# EAGLE design sdramps (EAGLE 5.11)
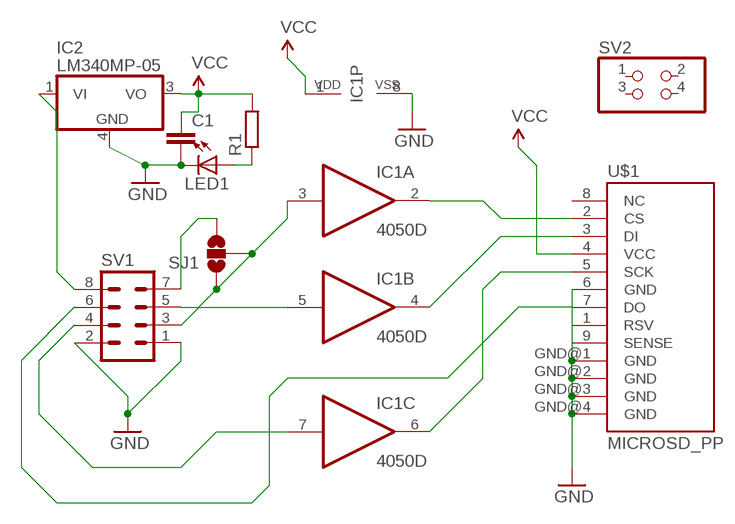
[diagram p0: schematic, sheet 1]

## Parts
C1  C-EUC1206K  [C1206K]
IC1  4050D  [SO16]
IC2  LM340MP-05  [SOT223]
LED1  LED1206  [LED-1206]
R1  R-EU_R1206W  [R1206W]
SJ1  SOLDERJUMPER_2WAYT  [SJ_2]
SV1  MA04-2  [MA04-2]
SV2  PINHD-2X2  [2X02]
U$1  MICROSD_PP  [MICROSD_PP]

## Nets
GND: C1.2 IC1.8(P:VSS) IC2.4(GND) LED1.C SV1.1 SV1.2 U$1.6(GND) U$1.GND@1(GND) U$1.GND@2(GND) U$1.GND@3(GND) U$1.GND@4(GND)
N$1: IC1.2(A:O) U$1.2(CS)
N$2: IC1.4(B:O) U$1.3(DI)
N$3: IC1.6(C:O) U$1.5(SCK)
N$4: SV1.6 U$1.7(DO)
N$5: SJ1.3 SV1.7
N$6: IC1.3(A:I) SJ1.1 SJ1.2 SV1.3
N$8: IC1.7(C:I) SV1.4
N$9: IC1.5(B:I) SV1.5
N$10: IC2.1(VI) SV1.8
N$11: LED1.A R1.1
VCC: C1.1 IC1.1(P:VDD) IC2.3(VO) R1.2 U$1.4(VCC)
Unconnected: IC1.9(D:I) IC1.10(D:O) IC1.11(E:I) IC1.12(E:O) IC1.14(F:I) IC1.15(F:O) SV2.1 SV2.2 SV2.3 SV2.4 U$1.1(RSV) U$1.8(NC) U$1.9(SENSE)

## Library data of the parts
C1 = rcl:C-EU: CAPACITOR, European symbol
IC1 = 40xx:4050: Hex non-inverting BUFFER
IC2 = linear:LM340?-*: Positive VOLTAGE REGULATOR Source: http://cache.national.com/ds/LM/LM340.pdf
LED1 = SparkFun:LED: LEDs Standard schematic elements and footprints for 5mm, 3mm, 1206, and 0603 sized LEDs. 5mm - Spark Fun Electronics SKU : COM-00529 (and others)
R1 = rcl:R-EU_: RESISTOR, European symbol
SJ1 = SparkFun:SOLDERJUMPER_2WAY: Solder Jumper 2 way solder jumper
SV1 = con-lstb:MA04-2: PIN HEADER; OC_FARNELL: unknown; OC_NEWARK: unknown
SV2 = pinhead:PINHD-2X2: PIN HEADER
U$1 = DE1594:MICROSD_PP

## Board
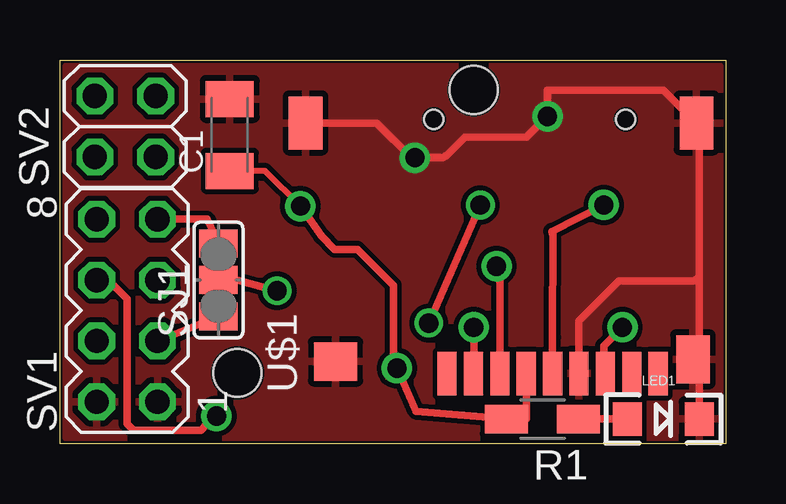
[diagram p1: board, top side]
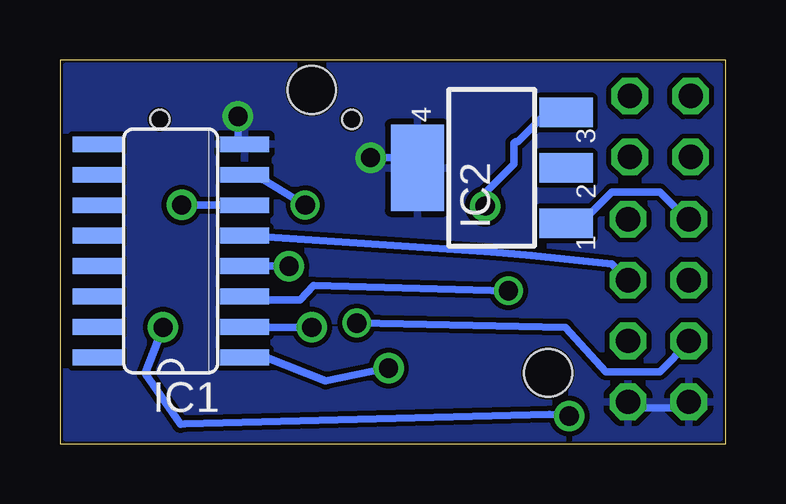
[diagram p2: board, bottom side, seen from below]

Size 27.75 x 16 mm. Coordinates in mm from the lower left corner, seen from the top.
Outline: 0,0 0,16 27.75,16 27.75,0 0,0
Copper layers (1*16): Top 0.035mm / dielectric 1.5mm / Bottom 0.035mm
Design rules "default *": minimum track width 10mil, minimum drill 24mil, track to track 8mil, track to pad 8mil, pad to pad 8mil, via to via 8mil, smd to smd 8mil, copper to edge 4mil, drill to drill 8mil, minimum pad ring 10mil, minimum via ring 8mil, stop-mask expansion 4mil, vias tented up to drill 0mil, thermal gap 10mil
Holes 2 mm at 17.25,14.75 7.4,2.95

### Footprints (pad centres in the part's own frame; a part is rotated, then mirrored left to right if it is on the bottom)
C1206K = smd 1.5 x 2: 1 -1.5,0; 2 1.5,0
SO16 = smd 0.66 x 2.032: 1 -4.445,-3.073; 2 -3.175,-3.073; 3 -1.905,-3.073; 4 -0.635,-3.073; 5 0.635,-3.073; 6 1.905,-3.073; 7 3.175,-3.073; 8 4.445,-3.073; 9 4.445,3.073; 10 3.175,3.073; 11 1.905,3.073; 12 0.635,3.073; 13 -0.635,3.073; 14 -1.905,3.073; 15 -3.175,3.073; 16 -4.445,3.073
SOT223 = smd 1.219 x 2.235: 1 -2.311,-3.099; 2 0,-3.099; 3 2.311,-3.099 | smd 3.6 x 2.2: 4 0,3.099
LED-1206 = smd 1.2 x 1.4: A -1.5,0; C 1.5,0
R1206W = smd 1.8 x 1.2: 1 -1.499,0; 2 1.499,0
SJ_2 = smd 1.168 x 1.6: 1 -1.524,0; 2 0,0; 3 1.524,0
MA04-2 = drill 1.016 octagon: 1 -3.81,-1.27; 2 -3.81,1.27; 3 -1.27,-1.27; 4 -1.27,1.27; 5 1.27,-1.27; 6 1.27,1.27; 7 3.81,-1.27; 8 3.81,1.27
2X02 = drill 1.016 octagon: 1 -1.27,-1.27; 2 -1.27,1.27; 3 1.27,-1.27; 4 1.27,1.27
MICROSD_PP = smd 1.8 x 0.8: 1 0,3.85; 2 0,2.75; 3 0,1.65; 4 0,0.55; 5 0,-0.55; 6 0,-1.65; 7 0,-2.75; 8 0,-3.85; 9 0,-4.95 | smd 1.6 x 1.8: GND@1 0.5,8.5 | smd 2.2 x 1.4: GND@2 10.45,9.75; GND@4 10.45,-6.55 | smd 2 x 1.4: GND@3 0.6,-6.4 | hole 0.8: 10.6,4.4; 10.6,-3.6

### Placement (x,y rotation side)
C1  7.08,12.88 90 top
IC1  23.13,8.04 90 bottom
IC2  9.75,11.5 90 bottom
LED1  25.15,1.02 0 top
R1  20.11,1.02 180 top
SJ1  6.61,6.82 90 top
SV1  2.8,5.55 90 top
SV2  2.72,13.22 90 top
U$1  19.99,2.92 90 top

### Tracks (layer width: path | path; a pad name or v marks a point on that pad's centre or on a via)
GND  (via drill 0.8 pad 1.27)
  Top 0.305: U$1.GND@2 13.21,13.37 14.65,11.93 v14.8,11.93 15.97,11.93 16.05,12 16.1,12 16.88,12.78 19.45,12.78 v20.32,13.65 20.32,14.75 25.16,14.75 U$1.GND@4 26.65,13.26 26.65,6.97 | 26.65,6.97 26.65,3.26 | 26.65,3.26 LED1.C | 26.65,3.26 U$1.GND@3 | U$1.6 21.64,5.12 23.3,6.78 26.45,6.78 26.65,6.97
  Bottom 0.305: SV1.1 3.75,1.5 1.75,1.5 SV1.2 | v20.32,13.65 20.32,12.47 20.07,12.47 IC1.8 | v14.8,11.93 12.85,11.93 IC2.4
  pour Top: 0.25,15.75 27.5,15.75 27.5,0.25 0.25,0.25
  pour Bottom: 0.25,15.75 27.5,15.75 27.5,0.25 0.25,0.25
N$1  (via drill 0.8 pad 1.27)
  Top 0.305: v17.25,4.85 U$1.2
  Bottom 0.305: v17.25,4.85 IC1.2
N$2  (via drill 0.8 pad 1.27)
  Top 0.305: v18.2,7.4 18.35,7.25 U$1.3
  Bottom 0.305: v18.2,7.4 IC1.4
N$3  (via drill 0.8 pad 1.27)
  Top 0.305: U$1.5 20.54,4.44 20.55,8.7 20.5,8.85 v22.68,9.95
  Bottom 0.305: v22.68,9.95 20.07,9.95 IC1.6
N$4  (via drill 0.8 pad 1.27)
  Top 0.305: SV1.6 2,6.82 2.8,6.03 2.8,0.82 3.08,0.55 5.88,0.55 6.1,0.78 v6.53,1.15 | v23.45,4.85 22.68,4.08 22.68,2.92 U$1.7
  Bottom 0.305: v6.53,1.15 7.35,1.23 22.55,0.82 22.73,0.8 24.2,2.92 v23.45,4.85
N$5
  Top 0.305: SV1.7 6.13,9.36 SJ1.3
N$6  (via drill 0.8)
  Top 0.254: SJ1.1 SJ1.2
  Top 0.305: SV1.3 4.09,4.28 SJ1.1 | v9.05,6.38 6.75,7 SJ1.2
  Bottom 0.305: IC1.3 19.25,6 17.75,6 17.18,6.6 v9.05,6.38
N$8  (via drill 0.8)
  Top 0.305: v15.38,5.03 v17.52,9.95
  Bottom 0.305: SV1.4 1.53,4.22 2.75,3 5,3 6.67,4.85 v15.38,5.03 | v17.52,9.95 19.25,11 IC1.7
N$9
  Bottom 0.305: IC1.5 9.77,8 8.1,7.85 4.75,7.5 SV1.5
N$10
  Bottom 0.305: SV1.8 1.61,9.36 2.75,10.5 4.75,10.5 5.75,9.5 6.34,9.5 IC2.1
N$11
  Top 0.305: R1.1 LED1.A
VCC  (via drill 0.8 pad 1.27)
  Top 0.254: v14.05,3.15 13.68,2.77 | C1.1 8.55,11.38 v10.03,9.9
  Top 0.305: U$1.4 19.45,2.9 19.45,1.02 R1.2 14.85,1.35 v14.05,3.15 13.9,2.98 13.9,6.6 12.4,8.1 11.45,8.1 10.9,8.65 v10.03,9.9
  Bottom 0.305: IC1.1 19.15,3.6 16.68,2.61 v14.05,3.15 | 7.45,13.81 IC2.3 | 7.45,13.81 7.54,13.81 | v10.03,9.9 10.03,10.45 8.82,11.65 8.82,12.53 8.75,12.6 8.66,12.6 7.45,13.81